# EAGLE design FqMeterBF_noali (EAGLE 7.2.0)
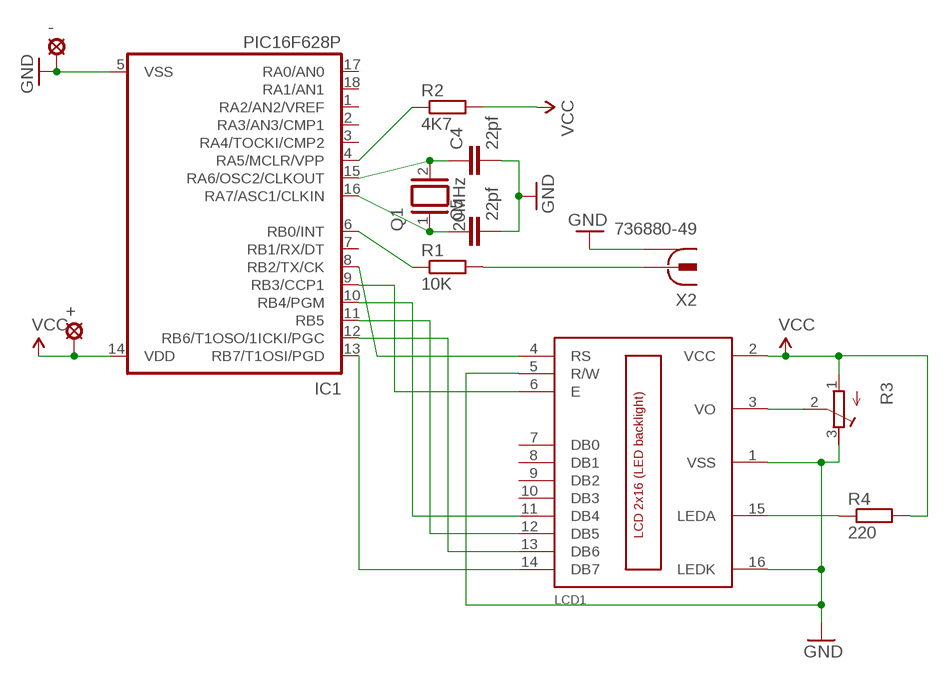
[diagram p0: schematic, sheet 1]

## Parts
+  LSP10  [LSP10]
-  LSP10  [LSP10]
C4  22pf  C-EU025-024X044  [C025-024X044]
C5  22pf  C-EU025-024X044  [C025-024X044]
IC1  PIC16F628P  [DIL18]
LCD1  LCD_2X16  [HY-1602F]
Q1  20MHz  XTAL/S  [QS]
R1  10K  R-EU_0207/12  [0207/12]
R2  4K7  R-EU_0207/12  [0207/12]
R3  R-TRIMM3339P  [RTRIM3339P]
R4  220  R-EU_0207/12  [0207/12]
X2  736880-49  [736880-49]

## Nets
GND: -.MP C4.2 C5.2 IC1.5(VSS) LCD1.1(VSS) LCD1.5(R/W) LCD1.16(LEDK) R3.3(E) X2.1 X2.1@1 X2.1@2
N$1: LCD1.15(LEDA) R4.1
N$2: C4.1 IC1.15(RA6/OSC2/CLKOUT) Q1.2
N$3: C5.1 IC1.16(RA7/ASC1/CLKIN) Q1.1
N$4: IC1.6(RB0/INT) R1.1
N$5: IC1.4(RA5/MCLR/VPP) R2.1
N$8: IC1.8(RB2/TX/CK) LCD1.4(RS)
N$9: IC1.9(RB3/CCP1) LCD1.6(E)
N$10: R1.2 X2.2
N$11: LCD1.3(VO) R3.2(S)
N$12: IC1.10(RB4/PGM) LCD1.11(DB4)
N$13: IC1.11(RB5) LCD1.12(DB5)
N$14: IC1.12(RB6/T1OSO/1ICKI/PGC) LCD1.13(DB6)
N$15: IC1.13(RB7/T1OSI/PGD) LCD1.14(DB7)
N$16: +.MP IC1.14(VDD) LCD1.2(VCC) R2.2 R3.1(A) R4.2 ; supply symbol labelled VCC
Unconnected: IC1.1(RA2/AN2/VREF) IC1.2(RA3/AN3/CMP1) IC1.3(RA4/TOCKI/CMP2) IC1.7(RB1/RX/DT) IC1.17(RA0/AN0) IC1.18(RA1/AN1) LCD1.7(DB0) LCD1.8(DB1) LCD1.9(DB2) LCD1.10(DB3)

## Library data of the parts
+ - = solpad:LSP10: SOLDER PAD drill 1.0 mm, distributor Buerklin, 12H555
C4 C5 = rcl:C-EU: CAPACITOR, European symbol
IC1 = microchip:PIC16*F62: FLASH-Based 8-Bit CMOS Microcontroller Source: http://ww1.microchip.com/downloads/en/DeviceDoc/40300C.pdf; MF: MICROCHIP; MPN: PIC16F628-20/P; OC_FARNELL: 9760423; OC_NEWARK: 23C4982
LCD1 = lcd_2x16_HD44780_led_backlight:LCD_2X16
Q1 = special:XTAL/S: CRYSTAL
R1 R2 R4 = rcl:R-EU_: RESISTOR, European symbol
R3 = rcl:R-TRIMM: Trimm resistor
X2 = con-conrad:736880-49: Cinch Connector ( RCA Jack ) Cinch-Einbaukupplung 90º 72345 Vernickelt BKL Electronic Source: Conrad <http://www.conrad.de/ce/de/product/736880>

## Board
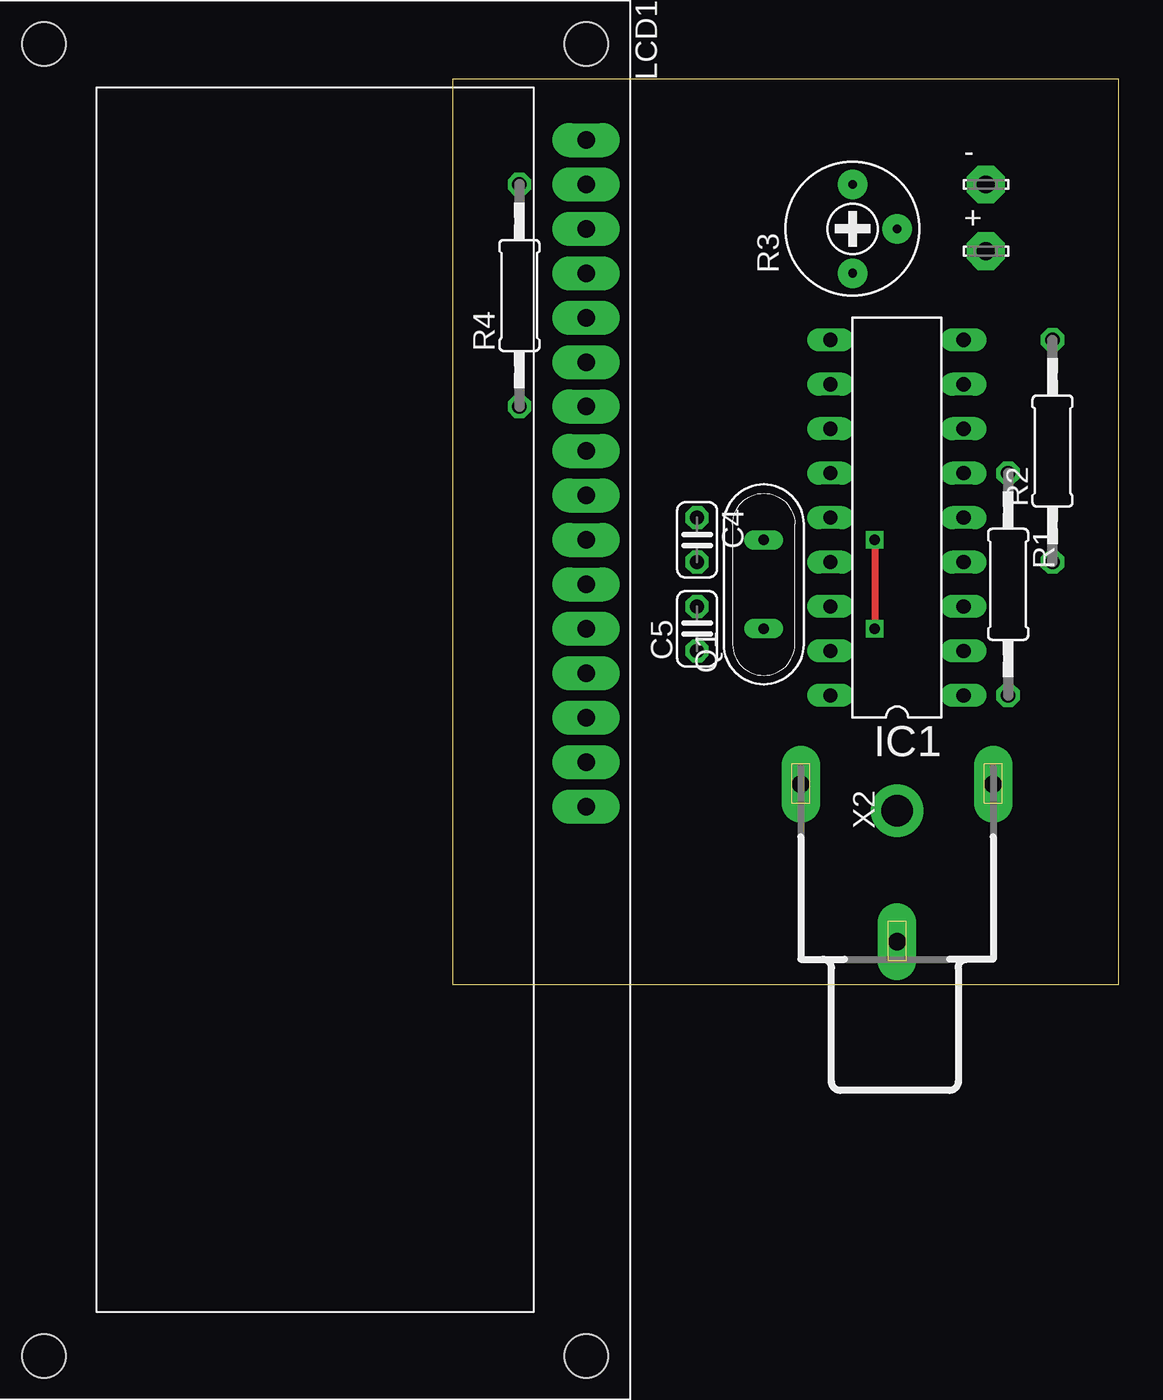
[diagram p1: board, top side]
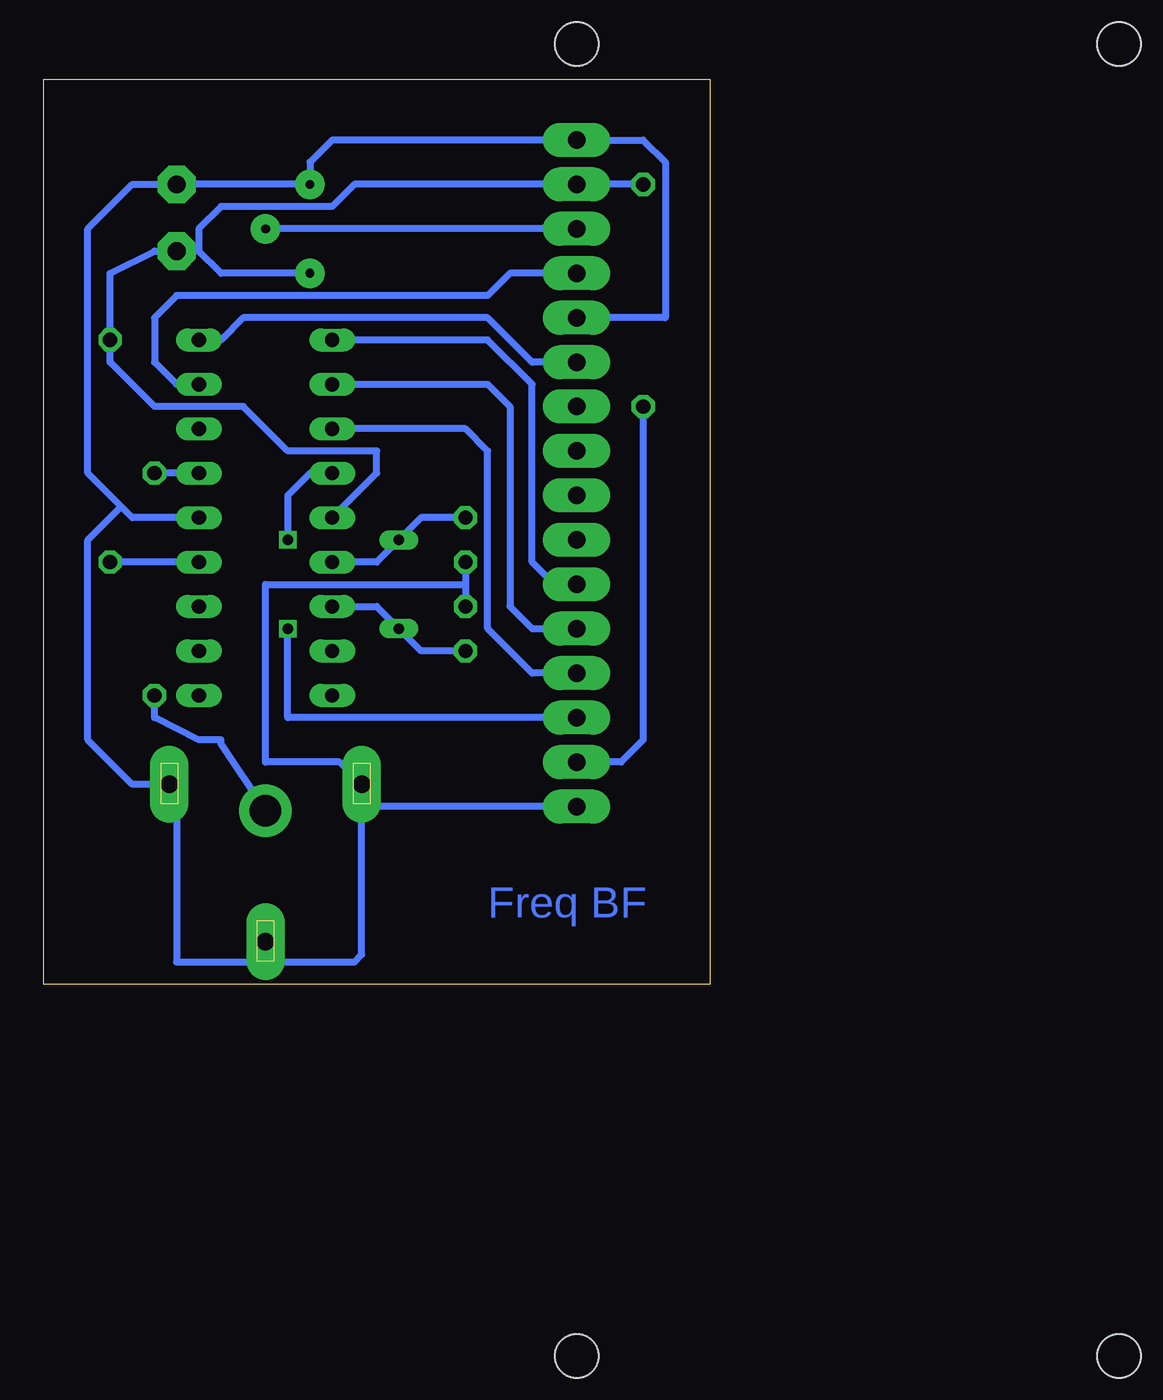
[diagram p2: board, bottom side, seen from below]

Size 38.08 x 51.74 mm. Coordinates in mm from the lower left corner, seen from the top.
Outline: 0,0 38.08,0 38.08,51.74 0,51.74 0,0
Copper layers (1*16): Top 0.035mm / dielectric 1.5mm / Bottom 0.035mm
Design rules "default": minimum track width 10mil, minimum drill 24mil, track to track 8mil, track to pad 8mil, pad to pad 8mil, via to via 8mil, smd to smd 8mil, copper to edge 40mil, drill to drill 8mil, minimum pad ring 10mil, minimum via ring 8mil, stop-mask expansion 4mil, vias tented up to drill 0mil, thermal gap 10mil

### Footprints (pad centres in the part's own frame; a part is rotated, then mirrored left to right if it is on the bottom)
LSP10 = drill 1.016 pad 2.159 octagon: MP 0,0
C025-024X044 = drill 0.813 octagon: 1 -1.27,0; 2 1.27,0
DIL18 = drill 0.813 long: 1 -10.16,-3.81; 2 -7.62,-3.81; 3 -5.08,-3.81; 4 -2.54,-3.81; 5 0,-3.81; 6 2.54,-3.81; 7 5.08,-3.81; 8 7.62,-3.81; 9 10.16,-3.81; 10 10.16,3.81; 11 7.62,3.81; 12 5.08,3.81; 13 2.54,3.81; 14 0,3.81; 15 -2.54,3.81; 16 -5.08,3.81; 17 -7.62,3.81; 18 -10.16,3.81
HY-1602F = drill 1 pad 1.93 long: 1 2.54,0; 2 5.08,0; 3 7.62,0; 4 10.16,0; 5 12.7,0; 6 15.24,0; 7 17.78,0; 8 20.32,0; 9 22.86,0; 10 25.4,0; 11 27.94,0; 12 30.48,0; 13 33.02,0; 14 35.56,0; 15 38.1,0; 16 40.64,0 | hole 2.5: -2.96,0; 72.04,0; -2.96,-31; 72.04,-31
QS = drill 0.61 long: 1 -2.54,0; 2 2.54,0
0207/12 = drill 0.813 octagon: 1 -6.35,0; 2 6.35,0
RTRIM3339P = drill 0.5 pad 1.676: 1 -2.54,0; 2 0,-2.54; 3 2.54,0
736880-49 = drill 1 pad 2.2 long: 1 -3.92,0; 1@1 5.08,-5.5; 1@2 5.08,5.5 | drill 1.8 pad 3: 2 3.58,0

### Placement (x,y rotation side)
+  30.48,41.91 0 top
-  30.48,45.72 0 top
C4  13.97,25.4 270 top
C5  13.97,20.32 90 top
IC1  25.4,26.67 90 top
LCD1  7.62,50.8 270 top
Q1  17.78,22.86 90 top
R1  31.75,22.86 270 top
R2  34.29,30.48 90 top
R3  22.86,43.18 90 top
R4  3.81,39.37 90 top
X2  25.4,6.35 90 top

### Tracks (layer width: path | path; a pad name or v marks a point on that pad's centre or on a via)
GND
  Bottom 0.406: 25.4,1.27 30.48,1.27 30.48,11.01 X2.1@1 33.02,11.43 35.56,13.97 35.56,25.4 33.66,27.3 | 25.4,1.27 20.32,1.27 19.9,1.69 19.9,10.16 | 19.9,10.16 X2.1@2 21.17,12.7 25.4,12.7 25.4,22.86 13.97,22.86 | X2.1 25.4,1.27 | LCD1.16 19.9,10.16 | LCD1.5 2.54,38.1 2.54,46.99 3.81,48.26 LCD1.1 21.59,48.26 22.86,46.99 R3.3 -.MP 33.02,45.72 35.56,43.18 35.56,29.21 33.66,27.3 | IC1.5 33.02,26.67 33.66,27.3 | C4.2 13.97,22.86 | 13.97,22.86 C5.2
N$1
  Bottom 0.406: R4.1 3.81,13.97 5.08,12.7 LCD1.15
N$2
  Bottom 0.406: IC1.15 19.05,24.13 Q1.2 16.51,26.67 C4.1
N$3
  Bottom 0.406: IC1.16 19.05,21.59 Q1.1 16.51,19.05 C5.1
N$4
  Bottom 0.406: IC1.6 R1.1
N$5
  Bottom 0.406: IC1.4 R2.1
N$8
  Bottom 0.406: LCD1.4 11.43,40.64 12.7,39.37 30.48,39.37 31.75,38.1 31.75,35.56 30.48,34.29 IC1.8
N$9
  Bottom 0.406: LCD1.6 10.16,35.56 12.7,38.1 26.67,38.1 27.94,36.83 IC1.9
N$10
  Bottom 0.406: X2.2 27.94,13.74 27.94,13.97 29.21,13.97 31.75,15.24 R1.2
N$11
  Bottom 0.406: LCD1.3 R3.2
N$12
  Bottom 0.406: LCD1.11 8.89,22.86 10.16,24.13 10.16,34.29 12.7,36.83 IC1.10
N$13
  Bottom 0.406: IC1.11 12.7,34.29 11.43,33.02 11.43,21.59 10.16,20.32 LCD1.12
N$14
  Bottom 0.406: LCD1.13 10.16,17.78 12.7,20.32 12.7,30.48 13.97,31.75 IC1.12
N$15  (via drill 0.6)
  Top 0.406: v24.13,25.4 v24.13,20.32
  Bottom 0.406: LCD1.14 24.13,15.24 v24.13,20.32 | IC1.13 22.86,29.21 24.13,27.94 v24.13,25.4
N$16
  Bottom 0.406: R3.1 27.94,40.64 29.21,41.91 | 29.21,41.91 +.MP 31.75,41.91 34.29,40.64 R2.2 34.29,35.56 31.75,33.02 26.67,33.02 24.13,30.48 19.05,30.48 19.05,29.21 IC1.14 | R4.2 LCD1.2 20.32,45.72 21.59,44.45 27.94,44.45 29.21,43.18 29.21,41.91

### Text on the board
Bottom: Freq BF